# EAGLE design Proximity_module (EAGLE 7.2.0)
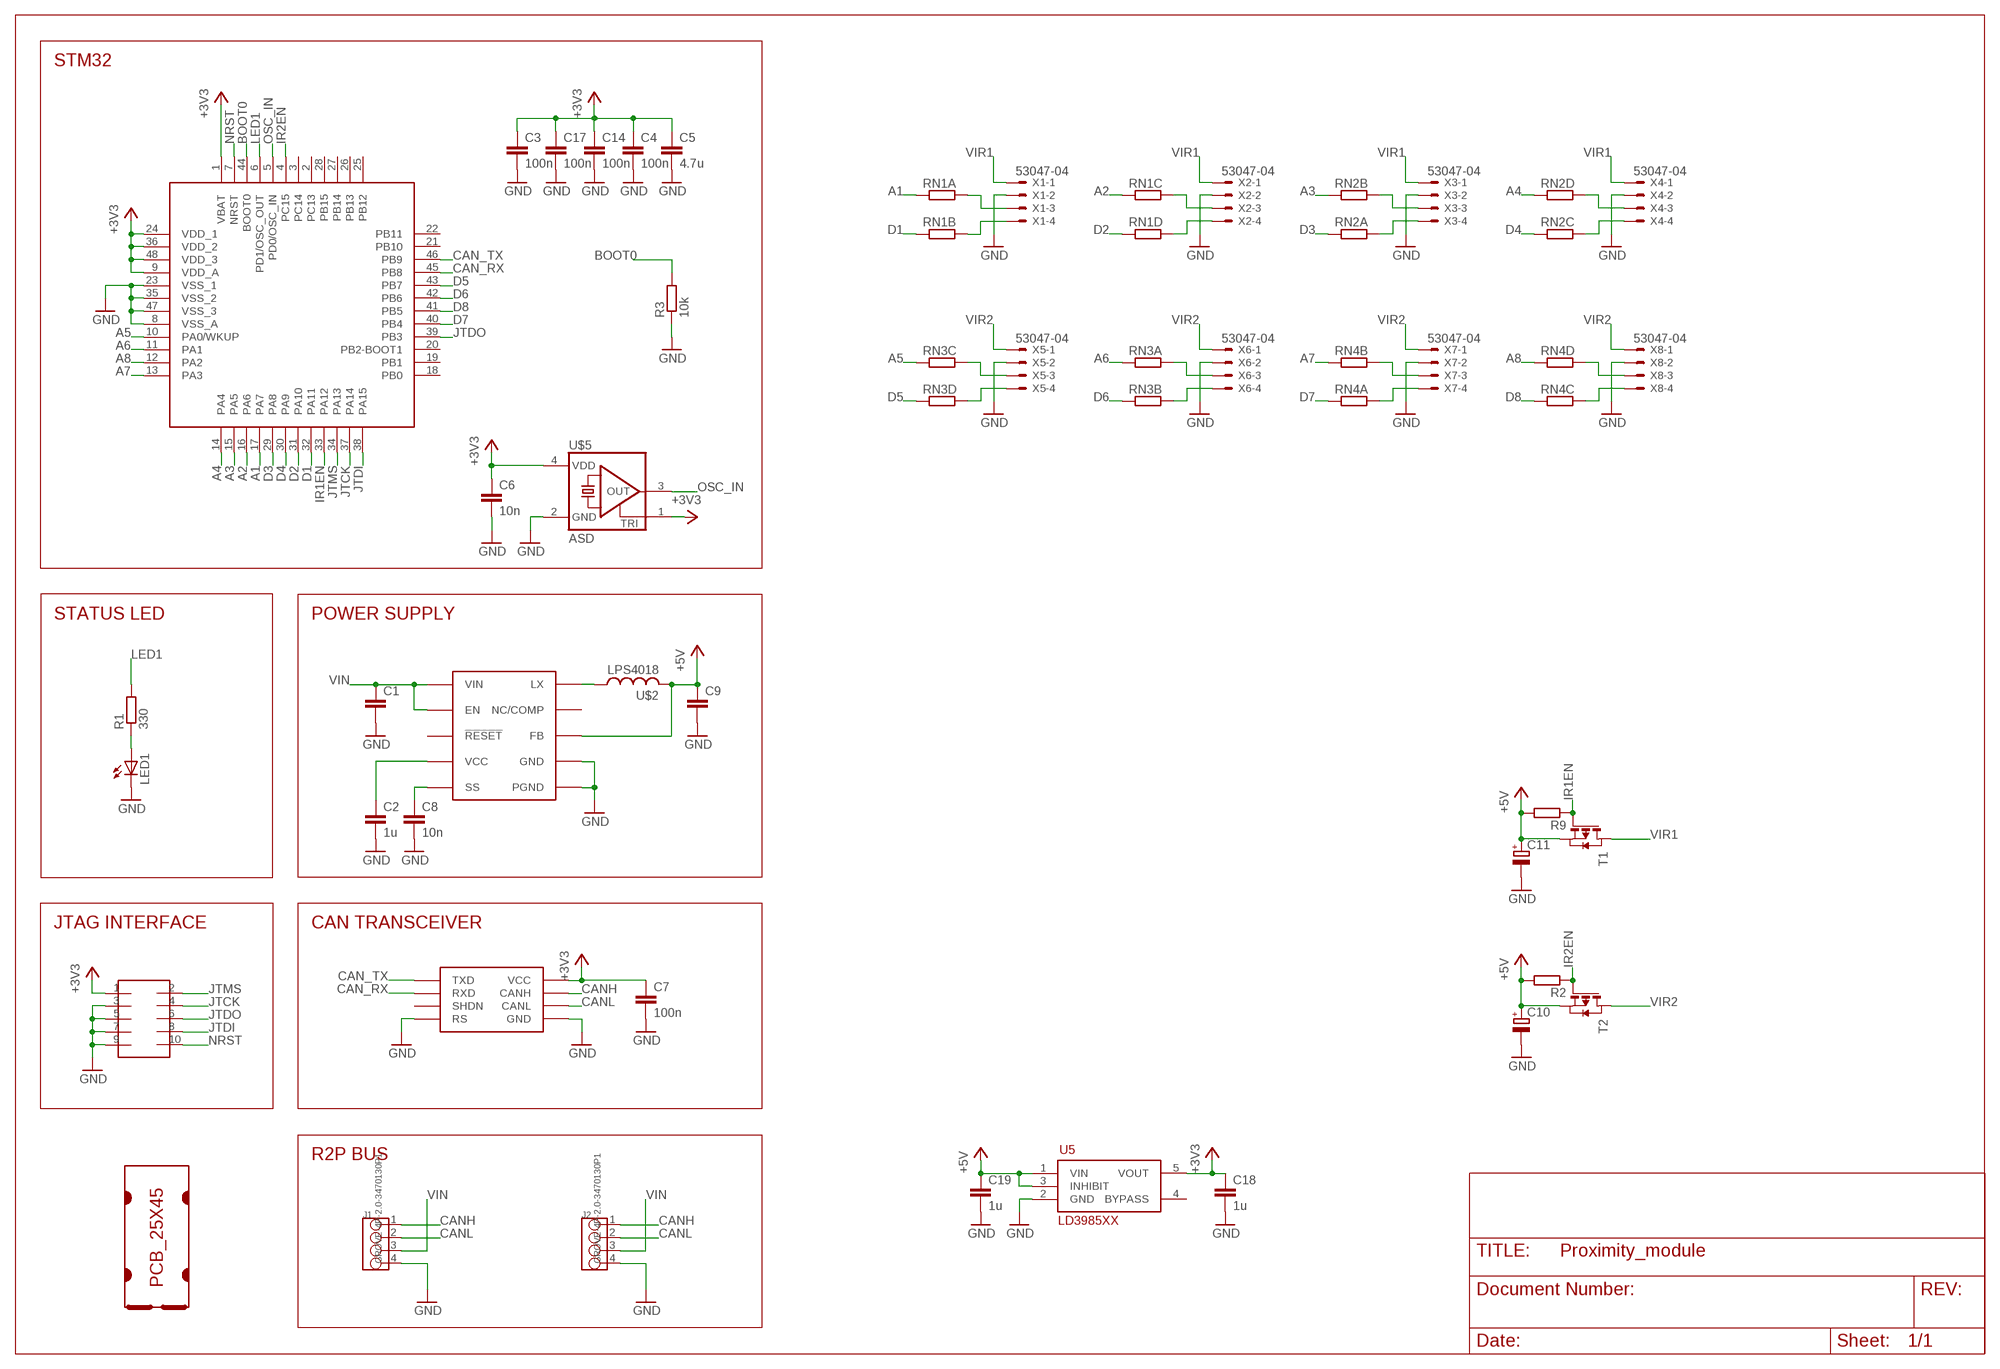
[diagram p0: schematic, sheet 1]

## Parts
C1  C-EUC1206  [C1206]
C2  1u  C-EUC0603  [C0603]
C3  100n  C-EUC0603  [C0603]
C4  100n  C-EUC0603  [C0603]
C5  4.7u  C-EUC0805  [C0805]
C6  10n  C-EUC0603  [C0603]
C7  100n  C-EUC0603  [C0603]
C8  10n  C-EUC0603  [C0603]
C9  C-EUC0805  [C0805]
C10  CPOL-EUB/3528-21R  [B/3528-21R]
C11  CPOL-EUB/3528-21R  [B/3528-21R]
C14  100n  C-EUC0603  [C0603]
C17  100n  C-EUC0603  [C0603]
C18  1u  C-EUC0603  [C0603]
C19  1u  C-EUC0603  [C0603]
J1  GROVE-4P-2.0-3470130P1  [4P-2.0]
J2  GROVE-4P-2.0-3470130P1  [4P-2.0]
LED1  LEDCHIPLED_0805  [CHIPLED_0805]
R1  330  R-EU_R0603  [R0603]
R2  R-EU_R0603  [R0603]
R3  10k  R-EU_R0603  [R0603]
R9  R-EU_R0603  [R0603]
RN1  RESISTOR_ARRAY_4  [RN8P-4R-CRA06S]
RN2  RESISTOR_ARRAY_4  [RN8P-4R-CRA06S]
RN3  RESISTOR_ARRAY_4  [RN8P-4R-CRA06S]
RN4  RESISTOR_ARRAY_4  [RN8P-4R-CRA06S]
SOT1  MAX3051EKA  [SOT23-8L]
T1  PMOSSOT23  [SOT-23]
T2  PMOSSOT23  [SOT-23]
U5  LD3985XX  [SOT23-5L]
U$1  PCB_25X45  [25X45]
U$2  LPS4018  [LPS4018]
U$3  MAX17501  [TDFN-10]
U$4  FTSH-105TH  [FTSH-105-TH]
U$5  ASD  [2.5X2]
U$6  STM32F103CXTX  [LQFP48]
X1  53047-04  [53047-04]
X2  53047-04  [53047-04]
X3  53047-04  [53047-04]
X4  53047-04  [53047-04]
X5  53047-04  [53047-04]
X6  53047-04  [53047-04]
X7  53047-04  [53047-04]
X8  53047-04  [53047-04]

## Nets
+3V3: C3.1 C4.1 C5.1 C6.1 C7.1 C14.1 C17.1 C18.1 SOT1.3(VCC) U5.5(VOUT) U$4.1 U$5.1(TRI) U$5.4(VDD) U$6.1(VBAT) U$6.9(VDD_A) U$6.24(VDD_1) U$6.36(VDD_2) U$6.48(VDD_3)
+5V: C9.1 C10.+ C11.+ C19.1 R2.2 R9.2 T1.2(S) T2.2(S) U5.1(VIN) U5.3(INHIBIT) U$2.P$2 U$3.P$5(FB)
A1: RN1.1 U$6.17(PA7)
A2: RN1.3 U$6.16(PA6)
A3: RN2.2 U$6.15(PA5)
A4: RN2.4 U$6.14(PA4)
A5: RN3.3 U$6.10(PA0/WKUP)
A6: RN3.1 U$6.11(PA1)
A7: RN4.2 U$6.13(PA3)
A8: RN4.4 U$6.12(PA2)
BOOT0: R3.2 U$6.44(BOOT0)
CAN_RX: SOT1.4(RXD) U$6.45(PB8)
CAN_TX: SOT1.1(TXD) U$6.46(PB9)
CANH: J1.1 J2.1 SOT1.7(CANH)
CANL: J1.2 J2.2 SOT1.6(CANL)
D1: RN1.2 U$6.32(PA11)
D2: RN1.4 U$6.31(PA10)
D3: RN2.1 U$6.29(PA8)
D4: RN2.3 U$6.30(PA9)
D5: RN3.4 U$6.43(PB7)
D6: RN3.2 U$6.42(PB6)
D7: RN4.1 U$6.40(PB4)
D8: RN4.3 U$6.41(PB5)
GND: C1.2 C2.2 C3.2 C4.2 C5.2 C6.2 C7.2 C8.2 C9.2 C10.- C11.- C14.2 C17.2 C18.2 C19.2 J1.4 J2.4 LED1.C R3.1 SOT1.2(GND) SOT1.8(RS) U5.2(GND) U$3.P$1(PGND) U$3.P$9(GND) U$3.P$11(PGND) U$4.3 U$4.5 U$4.7 U$4.9 U$5.2(GND) U$6.8(VSS_A) U$6.23(VSS_1) U$6.35(VSS_2) U$6.47(VSS_3) X1.2 X2.2 X3.2 X4.2 X5.2 X6.2 X7.2 X8.2
IR1EN: R9.1 T1.3(G) U$6.33(PA12)
IR2EN: R2.1 T2.3(G) U$6.4(PC15)
JTCK: U$4.4 U$6.37(PA14)
JTDI: U$4.8 U$6.38(PA15)
JTDO: U$4.6 U$6.39(PB3)
JTMS: U$4.2 U$6.34(PA13)
LED1: R1.2 U$6.6(PD1/OSC_OUT)
N$1: U$2.P$1 U$3.P$10(LX)
N$3: RN1.8 X1.3
N$4: LED1.A R1.1
N$5: RN1.7 X1.4
N$7: C2.1 U$3.P$4(VCC)
N$8: C8.1 U$3.P$6(SS)
N$10: RN1.6 X2.3
N$11: RN1.5 X2.4
N$12: RN2.7 X3.3
N$13: RN2.8 X3.4
N$14: RN2.5 X4.3
N$15: RN2.6 X4.4
N$16: RN4.5 X8.3
N$17: RN4.6 X8.4
N$18: RN4.7 X7.3
N$19: RN4.8 X7.4
N$20: RN3.8 X6.3
N$21: RN3.7 X6.4
N$22: RN3.6 X5.3
N$23: RN3.5 X5.4
NRST: U$4.10 U$6.7(NRST)
OSC_IN: U$5.3(OUT) U$6.5(PD0/OSC_IN)
VIN: C1.1 J1.3 J2.3 U$3.P$2(VIN) U$3.P$3(EN)
VIR1: T1.1(D) X1.1 X2.1 X3.1 X4.1
VIR2: T2.1(D) X5.1 X6.1 X7.1 X8.1
Unconnected: SOT1.5(SHDN) U5.4(BYPASS) U$3.P$7(NC/COMP) U$3.P$8(!RESET) U$6.2(PC13) U$6.3(PC14) U$6.18(PB0) U$6.19(PB1) U$6.20(PB2-BOOT1) U$6.21(PB10) U$6.22(PB11) U$6.25(PB12) U$6.26(PB13) U$6.27(PB14) U$6.28(PB15)

## Notes on the sheet
- STM32
- STATUS LED | POWER SUPPLY
- JTAG INTERFACE | CAN TRANSCEIVER
- R2P BUS

## Library data of the parts
C1-C9 C14 C17-C19 = rcl:C-EU: CAPACITOR, European symbol
C10 C11 = rcl:CPOL-EU: POLARIZED CAPACITOR, European symbol
J1 J2 = OPL Eagle Library:GROVE-4P-2.0
LED1 = led:LED: LED OSRAM: - CHIPLED LG R971, LG N971, LY N971, LG Q971, LY Q971, LO R971, LY R971 LH N974, LH R974 LS Q976, LO Q976, LY Q976 LO Q996 - Hyper CHIPLED LW Q18S LB Q993, LB Q99A, LB R99A - SideLED LS A670, LO A670, LY A670, LG A670, LP A670 LB A673, LV A673, LT A673, LW A673 LH A674 LY A675 LS A676, LA A676, LO A676, LY A676, LW A676 LS A679, LY A679, LG A679 - Hyper Micro SIDELED® LS Y876, LA Y876, LO Y876, LY Y876 LT Y87S - SmartLED LW L88C, LW L88S LB L89C, LB L89S, LG L890 LS L89K, LO L89K, LY L89K LS L896, LA L896, LO L896, LY L896 - TOPLED LS T670, LO T670, LY T670, LG T670, LP T670 LSG T670, LSP T670, LSY T670, LOP T670, LYG T670 LG T671, LOG T671, LSG T671 LB T673, LV T673, LT T673, LW T673 LH T674 LS T676, LA T676, LO T676, LY T676, LB T676, LH T676, LSB T676, LW T676 LB T67C, LV T67C, LT T67C, LS T67K, LO T67K, LY T67K, LW E67C LS E67B, LA E67B, LO E67B, LY E67B, LB E67C, LV E67C, LT E67C LW T67C LS T679, LY T679, LG T679 LS T770, LO T770, LY T770, LG T770, LP T770 LB T773, LV T773, LT T773, LW T773 LH T774 LS E675, LA E675, LY E675, LS T675 LS T776, LA T776, LO T776, LY T776, LB T776 LHGB T686 LT T68C, LB T68C - Hyper Mini TOPLED® LB M676 - Mini TOPLED Santana® LG M470 LS M47K, LO M47K, LY M47K Source: http://www.osram.convergy.de LUXEON: - LUMILED® LXK2-PW12-R00, LXK2-PW12-S00, LXK2-PW14-U00, LXK2-PW14-V00 LXK2-PM12-R00, LXK2-PM12-S00, LXK2-PM14-U00 LXK2-PE12-Q00, LXK2-PE12-R00, LXK2-PE12-S00, LXK2-PE14-T00, LXK2-PE14-U00 LXK2-PB12-K00, LXK2-PB12-L00, LXK2-PB12-M00, LXK2-PB14-N00, LXK2-PB14-P00, LXK2-PB14-Q00 LXK2-PR12-L00, LXK2-PR12-M00, LXK2-PR14-Q00, LXK2-PR14-R00 LXK2-PD12-Q00, LXK2-PD12-R00, LXK2-PD12-S00 LXK2-PH12-R00, LXK2-PH12-S00 LXK2-PL12-P00, LXK2-PL12-Q00, LXK2-PL12-R00 Source: www.luxeon.com KINGBRIGHT: KA-3528ASYC Source: www.kingbright.com
R1-R3 R9 = rcl:R-EU_: RESISTOR, European symbol
RN1-RN4 = dp_devices:RESISTOR_ARRAY_4: 4 Resistor Array 0603
SOT1 = maxim:MAX3051
T1 T2 = zetex:PMOSSOT23: MOS FET; OC_FARNELL: unknown; OC_NEWARK: unknown
U5 = st:LD3985XX
U$1 = r2p_pcb:PCB_25X45
U$2 = coilcraft:LPS4018
U$3 = maxim:MAX17501
U$4 = samtec:FTSH-105
U$5 = abracon:ASD
U$6 = st:STM32F103CX
X1-X8 = con-molex:53?-04: CONNECTOR wire to board 1.25 mm (.049 inch) pitch header; MF: WALDOM/MOLEX; MPN: 53047-0410; OC_FARNELL: 9733060; OC_NEWARK: 38C9900

## Board
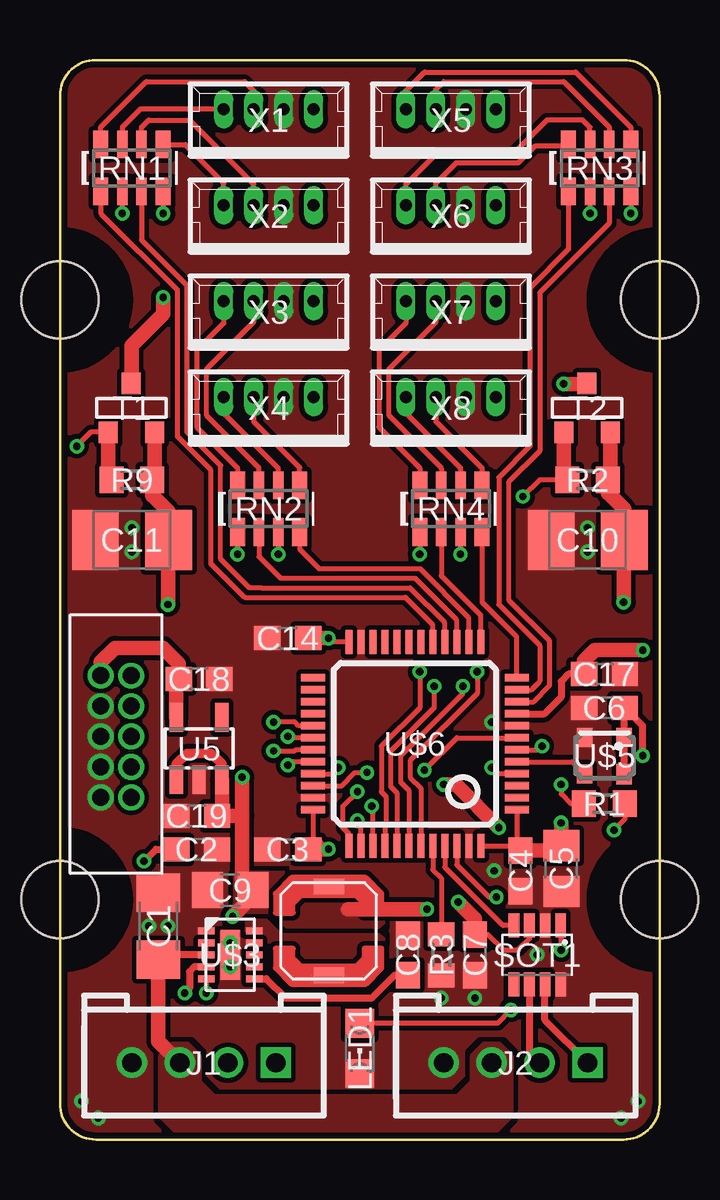
[diagram p1: board, top side]
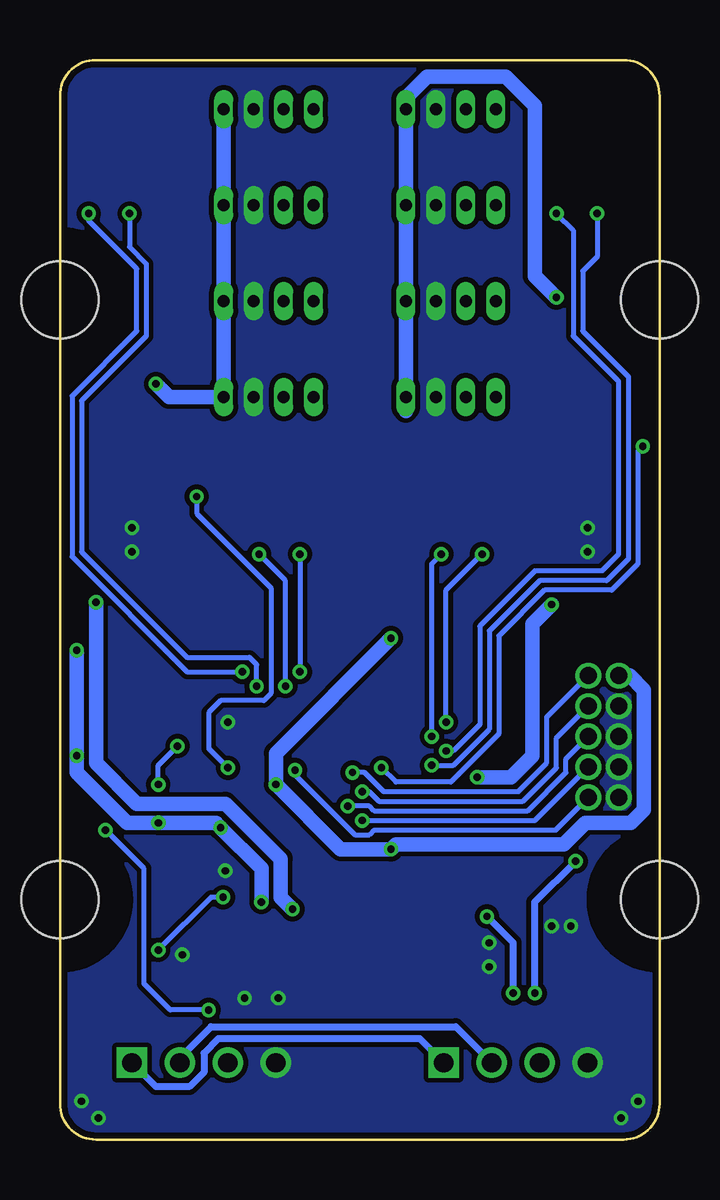
[diagram p2: board, bottom side, seen from below]

Size 25 x 45 mm. Coordinates in mm from the lower left corner, seen from the top.
Copper layers (1*16): Top 0.035mm / dielectric 1.5mm / Bottom 0.035mm
Design rules "test": minimum track width 0.2mm, minimum drill 0.3mm, track to track 0.2mm, track to pad 0.2mm, pad to pad 0.2mm, via to via 0.2mm, smd to smd 0mil, copper to edge 10mil, drill to drill 10mil, minimum pad ring 0.15mm, minimum via ring 0.15mm, stop-mask expansion 2mil, vias tented up to drill 100mil, thermal gap 10mil
tRestrict: 2 lines

### Footprints (pad centres in the part's own frame; a part is rotated, then mirrored left to right if it is on the bottom)
C1206 = smd 1.6 x 1.8: 1 -1.4,0; 2 1.4,0
C0603 = smd 1.1 x 1: 1 -0.85,0; 2 0.85,0
C0805 = smd 1.3 x 1.5: 1 -0.95,0; 2 0.95,0
B/3528-21R = smd 1.95 x 2.5: + 1.525,0; - -1.525,0
4P-2.0 = drill 0.8 pad 1.27 square: 1 -3,0 | drill 0.8 pad 1.27: 2 -1,0; 3 1,0; 4 3,0
CHIPLED_0805 = smd 1.2 x 1.2: A 0,-1.05; C 0,1.05
R0603 = smd 1 x 1.1: 1 -0.85,0; 2 0.85,0
RN8P-4R-CRA06S = smd 0.63 x 1.15: 1 -1.295,-0.975; 4 1.295,-0.975; 5 1.295,0.975; 8 -1.295,0.975 | smd 0.44 x 1.15: 2 -0.4,-0.975; 3 0.4,-0.975; 6 0.4,0.975; 7 -0.4,0.975
SOT23-8L = smd 0.45 x 1: 1 -0.975,-1.225; 2 -0.325,-1.225; 3 0.325,-1.225; 4 0.975,-1.225; 5 0.975,1.225; 6 0.325,1.225; 7 -0.325,1.225; 8 -0.975,1.225
SOT-23 = smd 0.787 x 0.889: 1 0.025,-1.016; 2 -0.94,1.016; 3 0.991,1.016
SOT23-5L = smd 0.55 x 1.2: 1 -0.95,-1.3; 2 0,-1.3; 3 0.95,-1.3; 4 0.95,1.3; 5 -0.95,1.3
25X45 = hole 3.2: 0,10; 25,10; 0,35; 25,35
LPS4018 = smd 0.635 x 1.27: P$1 -1.85,0; P$2 1.85,0
TDFN-10 = smd 0.7 x 0.3: P$1 -1,1; P$2 -1,0.5; P$3 -1,0; P$4 -1,-0.5; P$5 -1,-1; P$6 1,-1; P$7 1,-0.5; P$8 1,0; P$9 1,0.5; P$10 1,1 | smd 0.8 x 2.08: P$11 0,0
FTSH-105-TH = drill 0.711 pad 1.016: 1 -2.54,0; 2 -2.54,1.27; 3 -1.27,0; 4 -1.27,1.27; 5 0,0; 6 0,1.27; 7 1.27,0; 8 1.27,1.27; 9 2.54,0; 10 2.54,1.27
2.5X2 = smd 0.65 x 0.8: 1 -0.825,-0.762; 2 0.825,-0.762; 3 0.825,0.762 | smd 0.65 x 0.85: 4 -0.825,0.762
LQFP48 = smd 1 x 0.3: 1 -4.25,2.75; 2 -4.25,2.25; 3 -4.25,1.75; 4 -4.25,1.25; 5 -4.25,0.75; 6 -4.25,0.25; 7 -4.25,-0.25; 8 -4.25,-0.75; 9 -4.25,-1.25; 10 -4.25,-1.75; 11 -4.25,-2.25; 12 -4.25,-2.75; 25 4.25,-2.75; 26 4.25,-2.25; 27 4.25,-1.75; 28 4.25,-1.25; 29 4.25,-0.75; 30 4.25,-0.25; 31 4.25,0.25; 32 4.25,0.75; 33 4.25,1.25; 34 4.25,1.75; 35 4.25,2.25; 36 4.25,2.75 | smd 0.3 x 1: 13 -2.75,-4.25; 14 -2.25,-4.25; 15 -1.75,-4.25; 16 -1.25,-4.25; 17 -0.75,-4.25; 18 -0.25,-4.25; 19 0.25,-4.25; 20 0.75,-4.25; 21 1.25,-4.25; 22 1.75,-4.25; 23 2.25,-4.25; 24 2.75,-4.25; 37 2.75,4.25; 38 2.25,4.25; 39 1.75,4.25; 40 1.25,4.25; 41 0.75,4.25; 42 0.25,4.25; 43 -0.25,4.25; 44 -0.75,4.25; 45 -1.25,4.25; 46 -1.75,4.25; 47 -2.25,4.25; 48 -2.75,4.25
53047-04 = drill 0.5 pad 0.698 long: 1 1.875,0.45; 2 0.625,0.45; 3 -0.625,0.45; 4 -1.875,0.45

### Placement (x,y rotation side)
C1  4.1,8.9 90 top
C2  5.7,12.1 0 top
C3  9.5,12.1 180 top
C4  19.2,11.2 270 top
C5  20.9,11.3 270 top
C6  22.7,18 180 top
C7  17.3,7.7 270 top
C8  14.5,7.7 90 top
C9  7.1,10.4 180 top
C10  22,25 0 top
C11  3,25 0 top
C14  9.5,20.9 180 top
C17  22.7,19.4 0 top
C18  5.8,19.2 0 top
C19  5.7,13.5 180 top
J1  6,3.2 180 top
J2  19,3.2 180 top
LED1  12.5,3.8 180 top
R1  22.7,14 180 top
R2  22,27.5 0 top
R3  15.9,7.7 90 top
R9  3,27.5 0 top
RN1  3,40.5 0 top
RN2  8.7,26.3 0 top
RN3  22.5,40.5 0 top
RN4  16.3,26.3 0 top
SOT1  19.9,7.7 180 top
T1  3,30.5 180 top
T2  22,30.5 180 top
U5  5.8,16.3 0 top
U$1  0,0 0 top
U$2  11.2,8.7 90 top
U$3  7.1,7.7 0 top
U$4  1.7,16.8 270 top
U$5  22.7,16 180 top
U$6  14.8,16.5 180 top
X1  8.7,42.5 0 top
X2  8.7,38.5 0 top
X3  8.7,34.5 0 top
X4  8.7,30.5 0 top
X5  16.3,42.5 0 top
X6  16.3,38.5 0 top
X7  16.3,34.5 0 top
X8  16.3,30.5 0 top

### Tracks (layer width: path | path; a pad name or v marks a point on that pad's centre or on a via)
+3V3  (via drill 0.3)
  Top 0.2: C7.1 17.85,8.55 18.5,7.9 19.1,7.9 19.57,8.38 SOT1.3 | U$6.36 10.55,12.3 C3.1 | U$6.48 19,12.25 C4.1 19.05,12.2 U$6.1 | U$6.24 11.35,20.75 v11.2,20.9
  Top 0.3: U$6.9 20.2,17.75 20.9,18.45 20.9,19.1 21.2,19.4 C17.1 | C6.1 23.52,17.98 | v24.3,16 24.3,17.25 C6.1 | U$5.4 U$5.1 23.52,17.98 | 23.52,17.98 C6.1
  Top 0.6: 10.55,12.3 10.7,12.3 | C4.1 20.7,12.05 C5.1 20.9,13.1 v20.9,13.2 | C7.1 17.3,9.2 v16.6,9.9 | 21.8,19.45 C17.1 | C3.1 v11.2,12.1 | C17.1 21.9,19.45 | U$4.1 1.7,19.9 2.3,20.5 4.3,20.5 4.95,19.85 C18.1 4.85,19.1 U5.5 | C14.1 v11.2,20.9 | v16,14.8 16.5,14.8 v18.3,13 | v24.3,20.4 22.3,20.4 21.85,19.95 C17.1
  Bottom 0.6: U$4.1 1.24,19.34 0.65,18.75 0.65,13.75 1.2,13.2 3.1,13.2 4,12.3 11,12.3 v11.2,12.1 13.3,12.1 v16,14.8 16,16.1 v11.2,20.9 | v16.6,9.9 16.6,11.3 v18.3,13 18.5,13.2 v20.9,13.2 22.2,13.2 24.3,15.3 v24.3,16 v24.3,20.4
+5V  (via drill 0.3)
  Top 0.2: U$3.P$5 v6.1,6.1
  Top 0.4: U5.1 4.85,15.65 5.3,16.1 6.3,16.1 6.75,15.65 U5.3
  Top 0.5: 6.75,13.7 C19.1
  Top 0.6: v7.2,9.3 8.05,10.15 C9.1 7.6,10.85 7.6,13.5 | U5.3 6.75,13.7 | 7.6,13.5 v7.6,15.1 | C19.1 7.6,13.5 | T2.2 22.94,27.59 R2.2 22.85,26.95 22.9,26.9 23.52,26.27 C10.+ 23.5,24.98 v23.5,22.4 | T1.2 3.94,27.59 R9.2 3.85,26.85 3.9,26.8 4.53,26.18 C11.+ 4.5,24.98 v4.5,22.3 | v15.3,9.6 12,9.6
  Bottom 0.3: v6.1,6.1 6.1,8.2 v7.2,9.3
  Bottom 0.6: v7.6,15.1 6.2,15.1 5.3,16 5.3,21.5 v4.5,22.3 | v23.5,22.4 23.5,15.7 21.8,14 18.1,14 15.8,11.7 15.8,10.1 v15.3,9.6
  pour Top (rank 5, no thermals): 13.3,8.9 13.5,9.1 13.5,10.3 12.8,11 9.5,11 9.4,11.1 7.5,11.1 7.3,10.9 7.3,9.8 8.3,8.9
A1
  Top 0.2: U$6.17 15.55,21.45 14.4,22.6 7.7,22.6 6.3,24 6.3,27.9 4.9,29.3 4.9,35.4 1.71,38.59 RN1.1
A2
  Top 0.2: RN1.3 3.4,37.5 5.3,35.6 5.3,29.5 6.7,28.1 6.7,24.2 7.9,23 8.4,23 14.6,23 16.05,21.55 U$6.16
A3
  Top 0.2: RN2.2 8.3,24.3 9.2,23.4 14.8,23.4 16.55,21.65 U$6.15
A4
  Top 0.2: RN2.4 9.99,24.61 10.8,23.8 15,23.8 17.05,21.75 U$6.14
A5
  Top 0.2: RN3.3 22.9,38.2 20,35.3 20,28.7 18.7,27.4 18.7,22.5 20.4,20.8 20.4,18.9 19.75,18.25 U$6.10
A6
  Top 0.2: RN3.1 21.2,37.1 19.6,35.5 19.6,28.9 18.3,27.6 18.3,22.3 20,20.6 20,19.1 19.65,18.75 U$6.11
A7
  Top 0.2: RN4.2 15.9,23.5 17.55,21.85 U$6.13
A8
  Top 0.2: RN4.4 17.59,22.41 19.05,20.95 U$6.12
BOOT0
  Top 0.2: U$6.44 15.55,11.25 15.9,10.9 R3.2
CAN_RX
  Top 0.2: U$6.45 16.05,11.35 18.4,9 18.48,8.93 SOT1.4
CAN_TX  (via drill 0.3)
  Top 0.2: U$6.46 16.55,11.45 17.9,10.1 v18.2,10.1 | SOT1.1 20.88,7.92 v20.9,7.9
  Bottom 0.2: v18.2,10.1 18.7,10.1 v20.9,7.9
CANH
  Top 0.3: J2.1 20.23,4.97 SOT1.7
  Bottom 0.3: J1.1 10,4.2 18.4,4.2 19,3.6 19,2.8 19.6,2.2 21,2.2 J2.1
CANL
  Top 0.3: 19.57,3.62 J2.2 19.57,3.62 | SOT1.6 19.57,3.62
  Bottom 0.3: J1.2 8.5,4.7 18.7,4.7 20,3.4 J2.2
D1  (via drill 0.3)
  Top 0.2: RN1.2 v2.6,38.6 | U$6.32 9.65,15.75 v9.5,15.6
  Bottom 0.2: v2.6,38.6 2.6,36.8 3.2,36.2 3.2,33.7 1.3,31.8 1.3,24.2 2.2,23.3 5,23.3 7.1,21.2 7.1,17.1 8.6,15.6 v9.5,15.6
D2  (via drill 0.3)
  Top 0.2: RN1.4 v4.3,38.6 | v8.9,16.2 9.8,16.2 9.85,16.25 U$6.31
  Bottom 0.2: v4.3,38.6 3.6,37.9 3.6,33.5 1.7,31.6 1.7,24.4 2.4,23.7 5.2,23.7 7.5,21.4 7.5,17.3 8.6,16.2 v8.9,16.2
D3  (via drill 0.3)
  Top 0.2: RN2.1 v7.4,24.4 | U$6.29 9.95,17.25 9.8,17.4 v8.9,17.4
  Bottom 0.2: v8.9,17.4 8.9,22.9 v7.4,24.4
D4  (via drill 0.3)
  Top 0.2: RN2.3 v9.1,24.4 | U$6.30 9.55,16.75 v9.5,16.8
  Bottom 0.2: v9.5,16.8 9.5,24 v9.1,24.4
D5  (via drill 0.3)
  Top 0.2: RN3.4 v23.8,38.6 | U$6.43 15.05,14.65 14.6,15.1 14.6,15.8 17.4,18.6 v17.4,19.5
  Bottom 0.2: v17.4,19.5 19.7,19.5 24.5,24.3 24.5,31 21.8,33.7 21.8,36.3 23.8,38.3 v23.8,38.6
D6  (via drill 0.3)
  Top 0.2: RN3.2 v22.1,38.6 | U$6.42 14.55,14.55 14.2,14.9 14.2,16 16.8,18.6 v16.8,18.9
  Bottom 0.2: v22.1,38.6 22.1,37.2 21.4,36.5 21.4,33.5 24.1,30.8 24.1,24.5 19.7,20.1 17.1,20.1 16.8,19.8 v16.8,18.9
D7  (via drill 0.3)
  Top 0.2: RN4.1 v15,24.4 | U$6.40 13.55,13.05 13.6,13.1 13.6,14.3 13.4,14.5 13.4,16.4 15,18 v15,19.5
  Bottom 0.2: v15,24.4 v15,19.5
D8  (via drill 0.3)
  Top 0.2: RN4.3 v16.7,24.4 | U$6.41 14.05,14.45 13.8,14.7 13.8,16.2 15.6,18 v15.6,18.9
  Bottom 0.2: v15.6,18.9 15.6,23.3 v16.7,24.4
GND  (via drill 0.3)
  other vias: 7.1,8.2 7.1,7.2 4.5,8.9 3.7,8.9 15.9,5.9 17.3,5.9 19.9,7.7 24.1,1.6 23.4,0.9 1.6,0.9 0.9,1.6 18,17.4 18.1,11.2 3,25.5 3,24.5 22,25.5 22,24.5
  pour Bottom (rank 6, no thermals): 0,0 25,0 25,45 0,45
  pour Top (rank 6, no thermals): 0,0 25,0 25,45 0,45
IR1EN  (via drill 0.3)
  Top 0.2: T1.3 1.28,29.48 v0.7,28.9 | U$6.33 11.35,15.25 v11.6,15.5
  Top 0.6: 2.01,27.64 R9.1 | 2.01,27.64 R9.1 | T1.3 2.01,27.64 | 2.01,27.64 R9.1
  Bottom 0.2: v0.7,28.9 0.9,28.7 0.9,24 2,22.9 4.8,22.9 6.7,21 6.7,16.9 8.7,14.9 11,14.9 v11.6,15.5
IR2EN  (via drill 0.3)
  Top 0.2: R2.1 20,27.5 v19.3,26.8 | U$6.4 18.25,15.25 v18,15.5
  Top 0.6: 21.01,27.64 R2.1 | T2.3 21,27.65 | 21,27.65 R2.1 | 21,27.65 R2.1
  Bottom 0.2: v19.3,26.8 19.3,26.1 16.2,23 16.2,18.6 16.5,18.3 18.3,18.3 18.8,17.8 18.8,16.3 v18,15.5
JTCK  (via drill 0.3)
  Top 0.2: U$6.37 12.05,12.75 11.8,13 11.8,13.9 v12.4,14.5
  Bottom 0.2: v12.4,14.5 12.1,14.5 11.7,14.1 5.7,14.1 4.3,15.5 4.3,16.74 U$4.4
JTDI  (via drill 0.3)
  Top 0.2: U$6.38 12.55,13.15 v12.4,13.3
  Bottom 0.2: v12.4,13.3 5.2,13.3 U$4.8
JTDO  (via drill 0.3)
  Top 0.2: U$6.39 13.05,13.85 v13,13.9
  Bottom 0.2: v13,13.9 12.1,13.9 11.9,13.7 5.5,13.7 3.9,15.3 3.9,15.87 U$4.6
JTMS  (via drill 0.3)
  Top 0.2: U$6.34 11.75,14.75 12.3,15.3 v12.8,15.3
  Bottom 0.2: U$4.2 4.7,17.61 4.7,15.7 5.9,14.5 11.5,14.5 12.3,15.3 v12.8,15.3
LED1  (via drill 0.3 pad 0.2)
  Top 0.2: U$6.6 19.95,16.25 v20.1,16.4 | R1.2 21.3,14 20.9,14.4 v20.9,14.8
  Bottom 0.2: v20.9,14.8 20.9,15.6 v20.1,16.4
N$1
  pour Top (no thermals): 7.8,8.7 8.2,8.7 8.5,8.2 8.5,7.5 9.6,6.4 12.8,6.4 13.5,7.1 13.5,8.3 13.3,8.5 9.2,8.5 8.6,9.1 7.8,9.1
N$3
  Top 0.2: X1.3 8.07,43.73 7.7,44.1 3.6,44.1 1.71,42.2 RN1.8
N$4  (via drill 0.3)
  Top 0.2: R1.1 23.55,13.35 v23.1,12.9 | v18.8,5.4 18.25,4.85 LED1.A
  Bottom 0.2: v18.8,5.4 20.4,5.4 21.5,6.5 21.5,11.3 v23.1,12.9
N$5
  Top 0.2: X1.4 3.35,42.95 2.6,42.2 RN1.7
N$7  (via drill 0.3)
  Top 0.3: U$3.P$4 5.6,7.2 5.4,7 5.4,6.3 v5.2,6.1 | v3.5,11.6 4,12.1 C2.1
  Bottom 0.3: v5.2,6.1 5.2,9.9 v3.5,11.6
N$8
  Top 0.3: U$3.P$6 8.6,6.7 9.4,5.9 13,5.9 13.95,6.85 C8.1
N$10
  Top 0.2: RN1.6 3.4,42.2 3.7,42.5 5.4,42.5 8.07,39.83 X2.3
N$11
  Top 0.2: X2.4 6.83,39.88 5.22,41.48 RN1.5
N$12
  Top 0.2: X3.3 8.07,34.08 6.1,32.1 6.1,30.2 8.3,28 RN2.7
N$13
  Top 0.2: X3.4 6.83,34.02 5.7,32.9 5.7,29.7 7.4,28 RN2.8
N$14
  Top 0.2: X4.3 8.07,29.93 10,28 9.99,28 RN2.5
N$15
  Top 0.2: X4.4 6.83,30.27 9.1,28 RN2.6
N$16
  Top 0.2: X8.3 15.68,29.93 17.6,28 RN4.5
N$17
  Top 0.2: X8.4 14.43,30.27 16.7,28 RN4.6
N$18
  Top 0.2: X7.3 15.68,34.08 13.7,32.1 13.7,30.2 15.9,28 RN4.7
N$19
  Top 0.2: X7.4 14.43,34.02 13.3,32.9 13.3,29.7 15,28 RN4.8
N$20
  Top 0.2: X6.3 15.68,39.88 16.5,40.7 19.1,40.7 19.8,41.4 21.13,41.4 RN3.8
N$21
  Top 0.2: RN3.7 22.1,42.2 21.8,42.5 20.3,42.5 18.9,41.1 15.7,41.1 14.43,39.83 X6.4
N$22
  Top 0.2: X5.3 15.68,43.77 16,44.1 21,44.1 22.9,42.2 RN3.6
N$23
  Top 0.2: X5.4 14.43,43.73 15.2,44.5 21.5,44.5 23.8,42.2 RN3.5
NRST  (via drill 0.3)
  Top 0.2: v15.2,15.4 16.55,16.75 U$6.7
  Bottom 0.2: U$4.10 4.33,12.9 11.9,12.9 12.1,12.7 12.7,12.7 15,15 15.2,15.2 v15.2,15.4
OSC_IN
  Top 0.2: U$6.5 21.36,15.75 U$5.3
VIN
  Top 0.2: U$3.P$3 U$3.P$2
  Top 0.3: U$3.P$3 4.3,7.7 C1.1
  Top 0.6: C1.1 4.1,4.1 J1.3
  pour Top (no thermals): 4.7,4 5.3,4 5.8,3.5 5.8,2.4 6.4,1.8 16.6,1.8 17.2,2.4 17.2,3.5 17.7,4 18.3,4 18.8,3.5 18.8,1 17.8,0 5.2,0 4.2,1 4.2,3.5
VIR1  (via drill 0.3)
  Top 0.6: T1.1 2.99,31.5 2.99,33.09 4.3,34.4 v4.3,35.1
  Bottom 0.6: 10.57,30.38 X4.1 X3.1 X2.1 X1.1 10.57,43.42 9.7,44.3 6.4,44.3 5.2,43.1 5.2,36 v4.3,35.1
VIR2  (via drill 0.3)
  Top 0.6: v21,31.5 21.99,31.5 T2.1
  Bottom 0.6: X5.1 X6.1 X7.1 X8.1 20.45,30.95 v21,31.5

### Text on the board
Document: 1 | 5 | 2 | 6 | 3 | 7 | 4 | 8
200bmp: Proximity module / v1.1 (2014/12)